# Altium project Common_Sensor_Box.PrjPCB (part 4 of 17)

## Sheet Sensor_Box_Hub_SAMD21.SchDoc: Title
size 420 x 297 mm; Author: G.Kasprowicz; CompanyName: WUT ISE; DrawnBy: G.Kasprowicz; Organization: WUT ISE; Address1: PW ISE; Address2: Nowowiejska 15/19 00-665 Warsaw; Address3: gkasprow@gmail.com; Revision: 1.0; SheetNumber: -; SheetTotal: -; ModifiedBy: -; CheckedDate: -; Title2: Title2; DivGrp: WUT ISE; Designer: G.Kasprowicz; ModifiedDate: -; ProjectName: Sensor Box
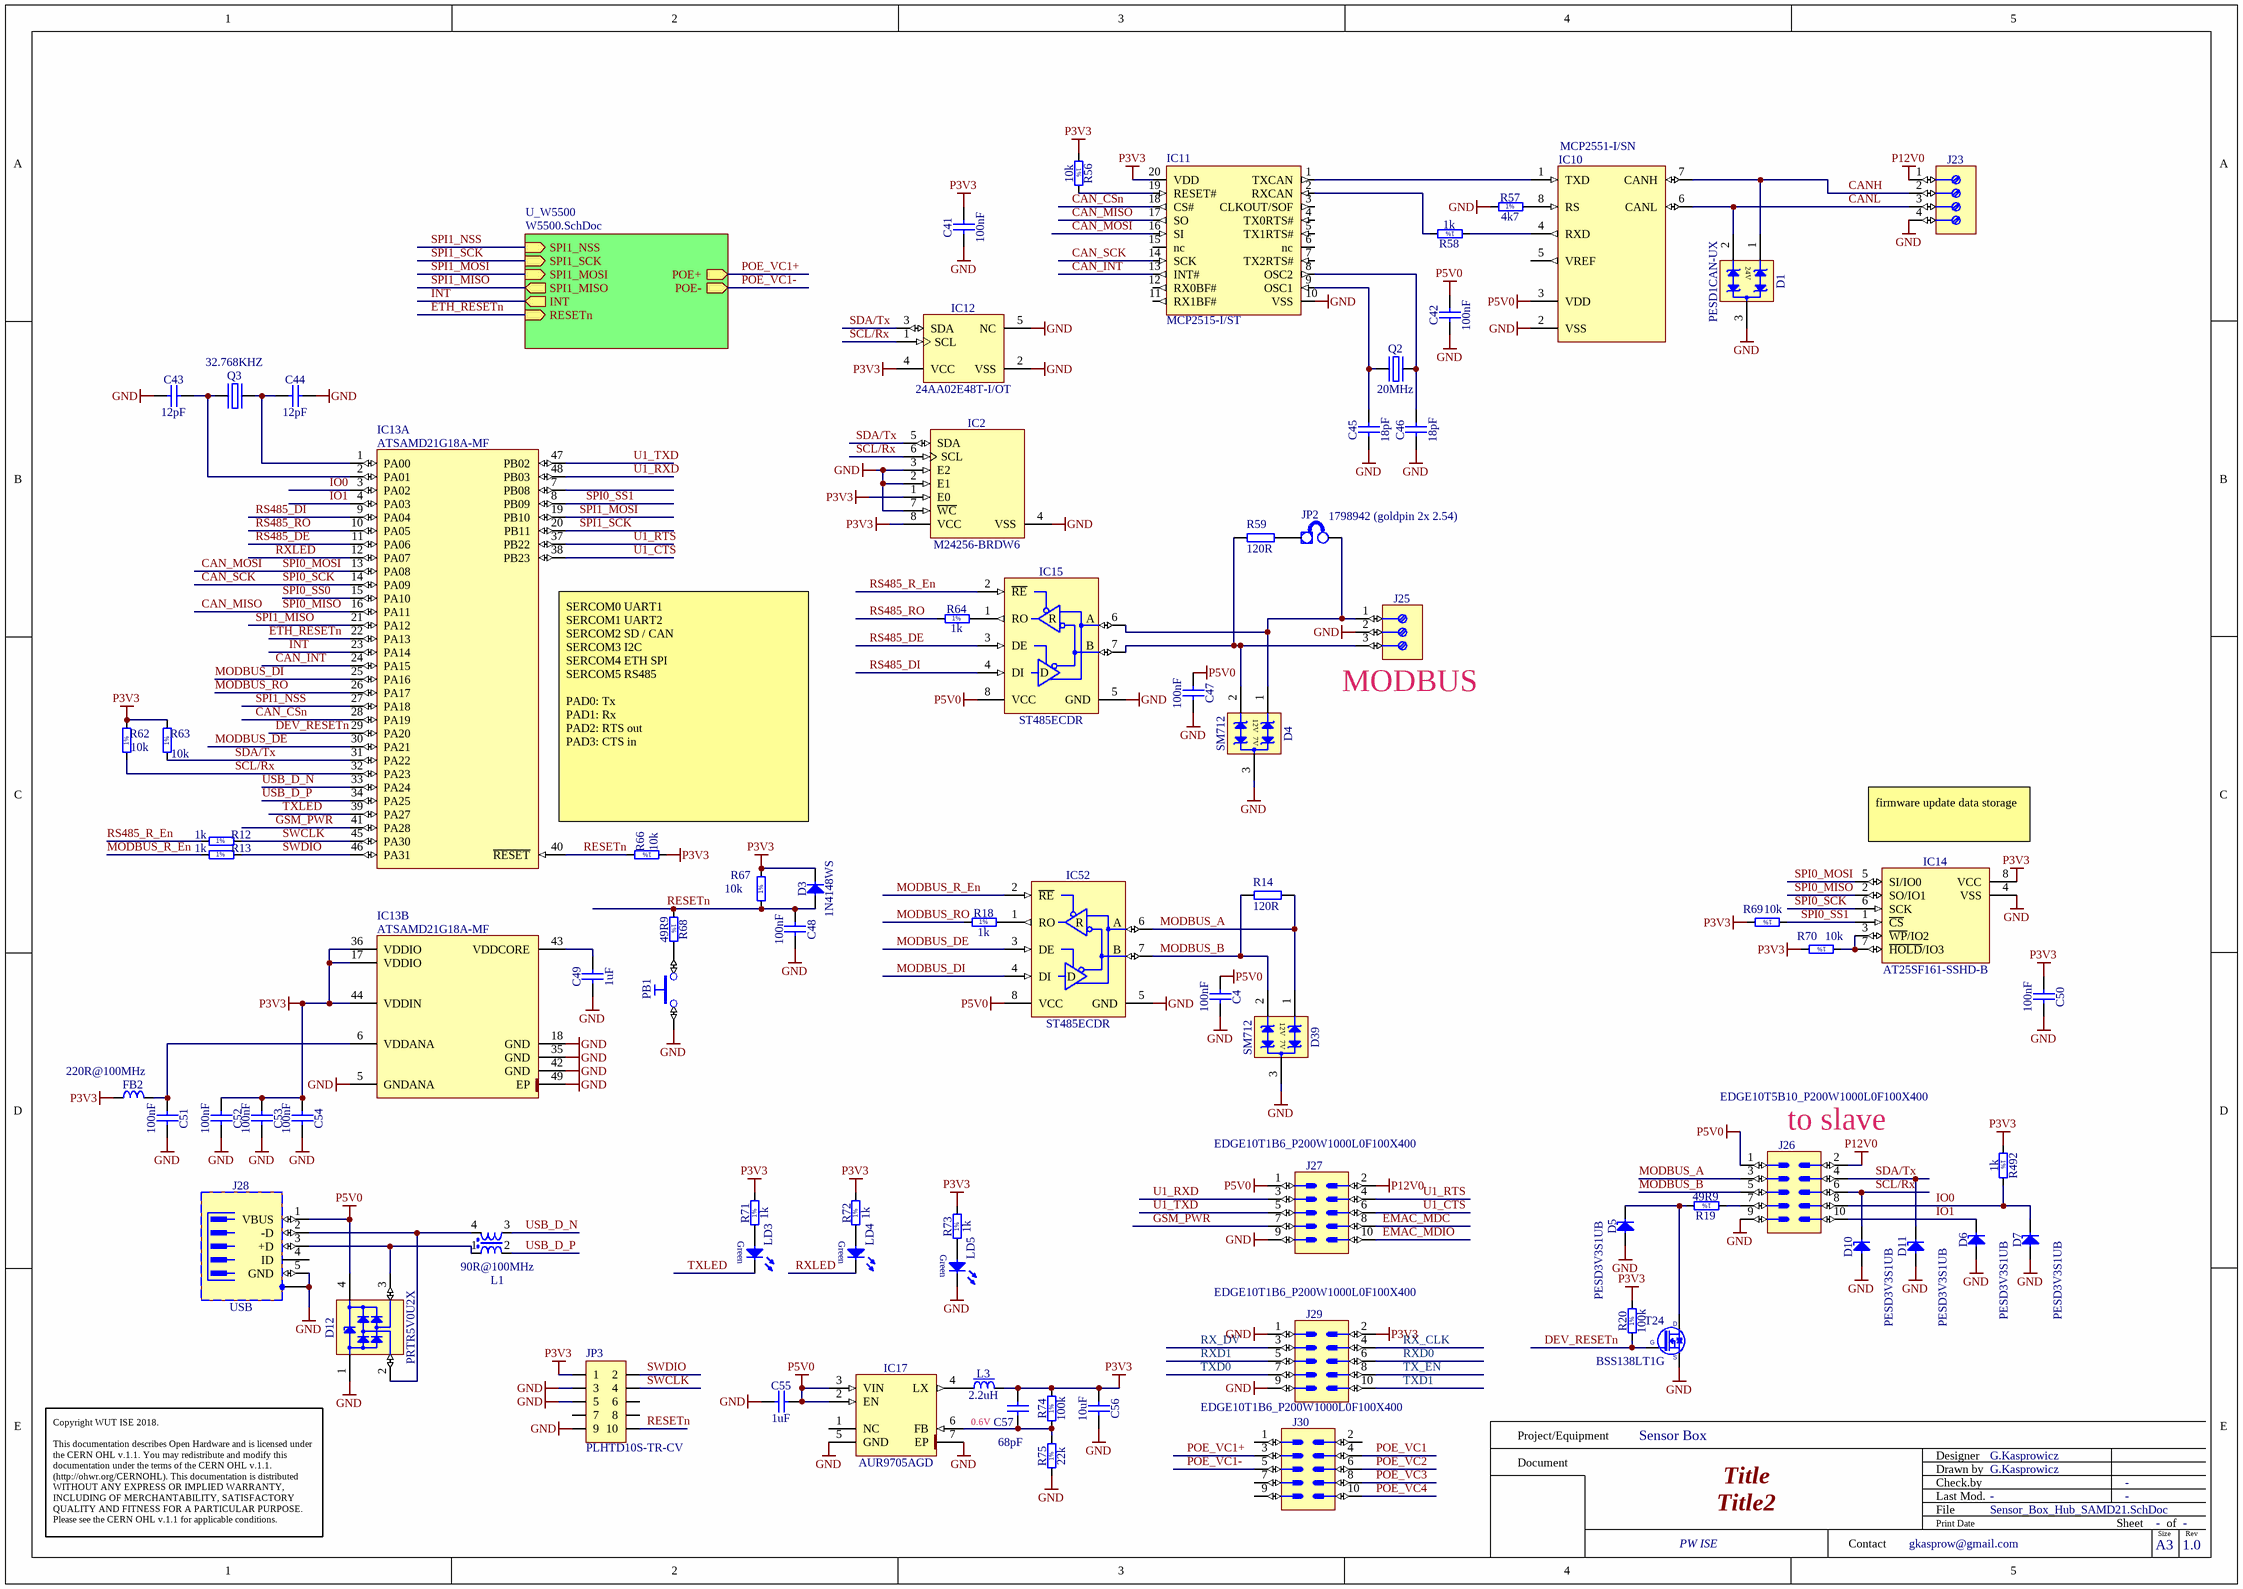
[diagram p5: Sensor_Box_Hub_SAMD21.SchDoc]

### Parts
(Parts that share a designator on the sheet are numbered #1, #2 ... from top to bottom, then left to right.)
C4  100nF  [CAPC1005X55N]
C41  100nF  [CAPC1005X55N]
C42  100nF  [CAPC1005X55N]
C43  12pF  [CAPC1005X55N]
C44  12pF  [CAPC1005X55N]
C45  18pF  [CAPC1005X55N]
C46  18pF  [CAPC1005X55N]
C47  100nF  [CAPC1005X55N]
C48  100nF  [CAPC1005X55N]
C49  1uF  [CAPC1608X87N]
C50  100nF  [CAPC1005X55N]
C51  100nF  [CAPC1005X55N]
C52  100nF  [CAPC1005X55N]
C53  100nF  [CAPC1005X55N]
C54  100nF  [CAPC1005X55N]
C55  1uF  [CAPC1005X55N]
C56  10uF  [CAPC2012X135N]
C57  68pF  [CAPC1608X87N]
D1  PESD1CAN-UX  [SOT95P237X112-3N]
D3  1N4148WS  [SODFL2512X100N]
D4  SM712  [SOT95P237X112-3N]
D5  PESD3V3S1UB  [SODFL1608X65N]
D6  PESD3V3S1UB  [SODFL1608X65N]
D7  PESD3V3S1UB  [SODFL1608X65N]
D10  PESD3V3S1UB  [SODFL1608X65N]
D11  PESD3V3S1UB  [SODFL1608X65N]
D12  PRTR5V0U2X  [SOT190P230X110-4N]
D39  SM712  [SOT95P237X112-3N]
FB2  220R@100MHz  [INDC2012X105N]
IC2#3  M24256-BRDW6  [SOP65P640X120-8N]
IC10  MCP2551-I/SN  [SOIC127P600X175-8N]
IC11  MCP2515-I/ST  [SOP65P640X110-20N]
IC12  24AA02E48T-I/OT  [SOT95P280X145-5N]
IC13  ATSAMD21G18A-MF  [QFN50P700X700X100-49N-S525]  (parts A,B of 2)
IC14  AT25SF161-SSHD-B  [SOIC127P790X216-8N]
IC15  ST485ECDR  [SOIC127P600X175-8N]
IC17  AUR9705AGD  [SON65P200X200X80-7N-R65X145]
IC52#1  ST485ECDR  [SOIC127P600X175-8N]
J23  (no value)  [PHOENIX_1725672]
J25  (no value)  [PHOENIX_1725669]
J26  (no value)  [EDGE10T5B10_P200W1000L0F100X400]
J27  (no value)  [EDGE10T1B6_P200W1000L0F100X400]
J28  USB  [MOLEX_105133-0011]
J29  (no value)  [EDGE10T1B6_P200W1000L0F100X400]
J30  (no value)  [EDGE10T1B6_P200W1000L0F100X400]
JP2  1798942 (goldpin 2x 2.54)  [jump]
JP3  PLHTD10S-TR-CV  [PLHTD10S-TR-CV]
L1  90R@100MHz  [IND_MURATA_DLW21S]
L3  2.2uH  [IND_MURATA_LQH44PN_P0]
LD3  Green  [LED_KINGBRIGHT_KPTR3216]  (value not drawn)
LD4  Green  [LED_KINGBRIGHT_KPTR3216]  (value not drawn)
LD5  Green  [LED_KINGBRIGHT_KPTR3216]  (value not drawn)
PB1  Push Button  [PB_TYCO_FSMSM]  (value not drawn)
Q2  20MHz  [XTAL1160X490X430]
Q3  32.768KHZ  [XTAL_ABRACON_ABS09]
R12  1k  [RESC1005X40N]
R13  1k  [RESC1005X40N]
R14  120R  [1206R]
R18  1k  [RESC1005X40N]
R19  49R9  [RESC1005X40N]
R20  100k  [RESC1005X40N]
R56  10k  [RESC1005X40N]
R57  4k7  [RESC1005X40N]
R58  1k  [RESC1005X40N]
R59  120R  [1206R]
R62  10k  [RESC1005X40N]
R63  10k  [RESC1005X40N]
R64  1k  [RESC1005X40N]
R66  10k  [RESC1005X40N]
R67  10k  [RESC1005X40N]
R68  49R9  [RESC1005X40N]
R69  10k  [RESC1005X40N]
R70  10k  [RESC1005X40N]
R71  1k  [RESC1005X40N]
R72  1k  [RESC1005X40N]
R73  1k  [RESC1005X40N]
R74  100k  [RESC1005X40N]
R75  22k  [RESC1005X40N]
R492  1k  [RESC1005X40N]
T24  BSS138LT1G  [SOT95P240X110-3N]

### Sub-sheets
U_W5500 = W5500.SchDoc: SPI1_NSS (in), SPI1_SCK (in), SPI1_MOSI (in), SPI1_MISO (out), INT (out), RESETn (in), POE+ (out), POE- (out)

### Nets
GND: C4.2 C41.1 C42.1 C43.1 C44.2 C45.1 C46.1 C47.2 C48.2 C49.1 C50.2 C51.2 C52.2 C53.2 C54.2 C55.1 C56.2 D1.3(GND) D4.3(GND) D5.2(A) D6.2(A) D7.2(A) D10.2(A) D11.2(A) D12.1(GND) D39.3(GND) IC2#3.2(E1) IC2#3.3(E2) IC2#3.4(VSS) IC2#3.7(~{WC}) IC10.2(VSS) IC11.10(VSS) IC12.2(VSS) IC12.5(NC) IC13.5(GNDANA) IC13.18(GND) IC13.35(GND) IC13.42(GND) IC13.49(EP) IC14.4(VSS) IC15.5(GND) IC17.5(GND) IC17.7(EP) IC52#1.5(GND) J23.4 J25.2 J26.9 J27.9 J28.5(GND) J28.6(SH) J29.1 J29.9 JP3.3 JP3.5 JP3.9 LD5.1(C) PB1.1 R57.1 R75.1 T24.2(S)
P3V3: C41.2 C50.1 C52.1 C53.1 C54.1 C56.1 C57.2 D3.1(C) FB2.1 IC2#3.1(E0) IC2#3.8(VCC) IC11.20(VDD) IC12.4(VCC) IC13.17(VDDIO) IC13.36(VDDIO) IC13.44(VDDIN) IC14.8(VCC) J29.2 JP3.1 L3.2 R20.2 R56.1 R62.2 R63.2 R66.1 R67.2 R69.2 R70.2 R71.2 R72.2 R73.2 R74.2 R492.1
P5V0: C4.1 C42.2 C47.1 C55.2 D12.4(VCC) IC10.3(VDD) IC15.8(VCC) IC17.2(EN) IC17.3(VIN) IC52#1.8(VCC) J26.1 J27.1 J28.1(VBUS)
P12V0: J23.1 J26.2 J27.2
CAN_CSn: IC11.18(CS#) IC13.28(PA19)
CAN_INT: IC11.13(INT#) IC13.24(PA15)
CAN_MISO: IC11.17(SO) IC13.16(PA11) IC14.2(SO/IO1)  [also labelled SPI0_MISO]
CAN_MOSI: IC11.16(SI) IC13.13(PA08) IC14.5(SI/IO0)  [also labelled SPI0_MOSI]
CAN_SCK: IC11.14(SCK) IC13.14(PA09) IC14.6(SCK)  [also labelled SPI0_SCK]
CANH: D1.1(I/O1) IC10.7(CANH) J23.2
CANL: D1.2(I/O2) IC10.6(CANL) J23.3
DEV_RESETn: IC13.29(PA20) R20.1 T24.1(G)
EMAC_MDC: J27.8
EMAC_MDIO: J27.10
ETH_RESETn: IC13.22(PA13) ; sheet U_W5500/RESETn
GSM_PWR: IC13.41(PA28) J27.7
INT: IC13.23(PA14) ; sheet U_W5500/INT
IO0: D7.1(C) IC13.3(PA02) J26.8 R492.2
IO1: D6.1(C) IC13.4(PA03) J26.10
MODBUS_A: D39.1(I/O1) IC52#1.6(A) J26.3 R14.2
MODBUS_B: D39.2(I/O2) IC52#1.7(B) J26.5 R14.1
MODBUS_DE: IC13.30(PA21) IC52#1.3(DE)
MODBUS_DI: IC13.25(PA16) IC52#1.4(DI)
MODBUS_R_En: IC52#1.2(~{RE}) R13.1
MODBUS_RO: IC13.26(PA17) R18.1
POE_VC1: J30.4
POE_VC1+: J30.3 ; sheet U_W5500/POE+
POE_VC1-: J30.5 ; sheet U_W5500/POE-
POE_VC2: J30.6
POE_VC3: J30.8
POE_VC4: J30.10
RESETn: C48.1 D3.2(A) IC13.40(~{RESET}) JP3.10 R66.2 R67.1 R68.1
RS485_DE: IC13.11(PA06) IC15.3(DE)
RS485_DI: IC13.9(PA04) IC15.4(DI)
RS485_R_En: IC15.2(~{RE}) R12.1
RS485_RO: IC13.10(PA05) R64.1
RX_CLK: J29.4
RX_DV: J29.3
RXD0: J29.6
RXD1: J29.5
RXLED: IC13.12(PA07) LD4.1(C)
SCL/Rx: D10.1(C) IC2#3.6(SCL) IC12.1(SCL) IC13.32(PA23) J26.6 R62.1
SDA/Tx: D11.1(C) IC2#3.5(SDA) IC12.3(SDA) IC13.31(PA22) J26.4 R63.1
SPI0_SS0: IC13.15(PA10)
SPI0_SS1: IC13.8(PB09) IC14.1(~{CS}) R69.1
SPI1_MISO: IC13.21(PA12) ; sheet U_W5500/SPI1_MISO
SPI1_MOSI: IC13.19(PB10) ; sheet U_W5500/SPI1_MOSI
SPI1_NSS: IC13.27(PA18) ; sheet U_W5500/SPI1_NSS
SPI1_SCK: IC13.20(PB11) ; sheet U_W5500/SPI1_SCK
SWCLK: IC13.45(PA30) JP3.4 R12.2
SWDIO: IC13.46(PA31) JP3.2 R13.2
TX_EN: J29.8
TXD0: J29.7
TXD1: J29.10
TXLED: IC13.39(PA27) LD3.1(C)
U1_CTS: IC13.38(PB23) J27.6
U1_RTS: IC13.37(PB22) J27.4
U1_RXD: IC13.48(PB03) J27.3
U1_TXD: IC13.47(PB02) J27.5
USB_D_N: IC13.33(PA24) L1.3
USB_D_P: IC13.34(PA25) L1.2
NetC43_2: C43.2 IC13.2(PA01) Q3.1(OSC1)
NetC44_1: C44.1 IC13.1(PA00) Q3.2(OSC2)
NetC45_2: C45.2 IC11.9(OSC1) Q2.1(OSC1)
NetC46_2: C46.2 IC11.8(OSC2) Q2.2(OSC2)
NetC49_2: C49.2 IC13.43(VDDCORE)
NetC51_1: C51.1 FB2.2 IC13.6(VDDANA)
NetC57_1: C57.1 IC17.6(FB) R74.1 R75.2
NetD4_1: D4.1(I/O1) IC15.6(A) J25.1 JP2.2(E2)
NetD4_2: D4.2(I/O2) IC15.7(B) J25.3 R59.1
NetD5_1: D5.1(C) R19.2 T24.3(D)
NetD12_2: D12.2(I/O1) J28.2(-D) L1.4
NetD12_3: D12.3(I/O2) J28.3(+D) L1.1
NetIC10_1: IC10.1(TXD) IC11.1(TXCAN)
NetIC10_4: IC10.4(RXD) R58.1
NetIC10_8: IC10.8(RS) R57.2
NetIC11_2: IC11.2(RXCAN) R58.2
NetIC11_19: IC11.19(RESET#) R56.2
NetIC14_3: IC14.3(~{WP}/IO2) IC14.7(~{HOLD}/IO3) R70.1
NetIC15_1: IC15.1(RO) R64.2
NetIC17_4: IC17.4(LX) L3.1
NetIC52#1_1: IC52#1.1(RO) R18.2
NetJ26_7: J26.7 R19.1
NetJP2_1: JP2.1(E1) R59.2
NetLD3_2: LD3.2(A) R71.1
NetLD4_2: LD4.2(A) R72.1
NetLD5_2: LD5.2(A) R73.1
NetPB1_2: PB1.2 R68.2

Not connected (* = marked no-connect by the designer): IC10 5(VREF); IC11 3(CLKOUT/SOF) 4(TX0RTS#) 5(TX1RTS#) 6(nc) 7(TX2RTS#) 11(RX1BF#) 12(RX0BF#) 15(nc); IC13 7(PB08); IC17 1(NC); J28 4(ID); J30 1 2 7 9; JP3 6 7 8

### Notes on the sheet
- (near J25) MODBUS
- SERCOM0 UART1
  SERCOM1 UART2
  SERCOM2 SD / CAN
  SERCOM3 I2C
  SERCOM4 ETH SPI
  SERCOM5 RS485
  PAD0: Tx
  PAD1: Rx
  PAD2: RTS out
  PAD3: CTS in
- (near IC14) firmware update data storage
- (near J26) to slave
- 0.6V
- Project/Equipment
- Document
- Designer
- Drawn by
- Check.by
- Copyright WUT ISE 2018.
  This documentation describes Open Hardware and is licensed under the CERN OHL v.1.1. You may redistribute and modify this documentation under the terms of the CERN OHL v.1.1. (http://ohwr.org/CERNOHL). This documentation is distributed WITHOUT ANY EXPRESS OR IMPLIED WARRANTY, INCLUDING OF MERCHANTABILITY, SATISFACTORY QUALITY AND FITNESS FOR A PARTICULAR PURPOSE. Please see the CERN OHL v.1.1 for applicable conditions.
- Contact
- File
- Last Mod.
- Print Date
- Sheet
- Size
- A3
- of
- Rev
- (in symbol R0402_1K_1%_0.0625W_100PPM) 1%
- (in symbol R0402_4K7_1%_0.0625W_100PPM) 1%
- (in symbol R0402_10K_1%_0.0625W_100PPM) 1%
- (in symbol R0402_22K_1%_0.0625W_100PPM) 1%
- (in symbol R0402_49R9_1%_0.0625W_100PPM) 1%
- (in symbol R0402_100K_1%_0.0625W_100PPM) 1%
- (in symbol SM712) 12V; 7V
- (in symbol ST485ECDR) R; D

### Library data of the parts
C4 C47 C48 C50-C54 = CC0402_100NF_16V_10%_X7R: Non-polarised capacitor; Part Description: SMD Multilayer Chip Ceramic Capacitor; Manufacturer: GENERIC; Manufacturer1 Part Number: GRM155R71C104KA88D; Voltage: 16V; TC: X7R; Tolerance: ±10%; Part Number: CC0402_100NF_16V_10%_X7R; Component Kind: Standard; Component Type: Standard; Pin Count: 2; Value: 100nF; Status: Not Recommended; Manufacturer Part Number: CC0402_100NF_16V_10%_X7R; Case: 0402; Mounted: Yes; Socket: No; SMD: Yes; Manufacturer1 Example: MURATA; Manufacturer1 ComponentHeight: 0.55mm; HelpURL: \\cern.ch\dfs\Applications\Altium\Datasheets\CC0402_X7R_MURATA_GRM.pdf; Author: CERN DEM JLC; CreateDate: 05.12.2013; LatestRevisionDate: 03.12.2007; Sense: No
C41 C42 = CC0402_100NF_16V_10%_X5R: Non-polarised capacitor; Part Description: SMD Multilayer Chip Ceramic Capacitor; Manufacturer: GENERIC; Manufacturer1 Part Number: GRM155R61C104KA88D; Voltage: 16V; TC: X5R; Tolerance: ±10%; Part Number: CC0402_100NF_16V_10%_X5R; Component Kind: Standard; Component Type: Standard; Pin Count: 2; Value: 100nF; Status: None; Manufacturer Part Number: CC0402_100NF_16V_10%_X5R; Case: 0402; Mounted: Yes; Socket: No; SMD: Yes; Sense: No; Manufacturer1 Example: MURATA; Manufacturer1 ComponentHeight: 0.55mm; HelpURL: \\cern.ch\dfs\Applications\Altium\Datasheets\CC0402_X5R_MURATA_GRM.pdf; Author: CERN DEM JLC; CreateDate: 10.12.2013; LatestRevisionDate: 10.12.2013
C43 C44 = CC0402_12PF_50V_5%_C0G: Non-polarised capacitor; Part Description: SMD Multilayer Chip Ceramic Capacitor; Manufacturer: GENERIC; Manufacturer1 Part Number: C0402C120J5GACTU; Voltage: 50V; TC: C0G/NP0; Tolerance: ±5%; Part Number: CC0402_12PF_50V_5%_C0G; Component Kind: Standard; Component Type: Standard; Pin Count: 2; Value: 12pF; Status: Preferred; Manufacturer Part Number: CC0402_12PF_50V_5%_C0G; Case: 0402; Mounted: Yes; Socket: No; SMD: Yes; Sense: No; Manufacturer1 Example: KEMET; Manufacturer1 ComponentHeight: 0.55mm; HelpURL: \\cern.ch\dfs\Applications\Altium\Datasheets\CC0805_C0G_KEMET_(Commercial Grade).pdf; Author: CERN DEM JLC; CreateDate: 04.10.2016; LatestRevisionDate: 04.10.2016
C45 C46 = CC0402_18PF_50V_5%_C0G: Non-polarised capacitor; Part Description: SMD Multilayer Chip Ceramic Capacitor; Manufacturer: GENERIC; Manufacturer1 Part Number: C0402C180J5GACTU; Voltage: 50V; TC: C0G/NP0; Tolerance: ±5%; Part Number: CC0402_18PF_50V_5%_C0G; Component Kind: Standard; Component Type: Standard; Pin Count: 2; Value: 18pF; Status: Preferred; Manufacturer Part Number: CC0402_18PF_50V_5%_C0G; Case: 0402; Mounted: Yes; Socket: No; SMD: Yes; Sense: No; Manufacturer1 Example: KEMET; Manufacturer1 ComponentHeight: 0.55mm; HelpURL: \\cern.ch\dfs\Applications\Altium\Datasheets\CC0805_C0G_KEMET_(Commercial Grade).pdf; Author: CERN DEM JLC; CreateDate: 04.10.2016; LatestRevisionDate: 04.10.2016
C49 = CC0603_1UF_16V_10%_X7R: Non-polarised capacitor; Part Description: SMD Multilayer Chip Ceramic Capacitor; Manufacturer: GENERIC; Manufacturer1 Part Number: 223878615663; Voltage: 16V; TC: X7R; Tolerance: ±10%; Part Number: CC0603_1UF_16V_10%_X7R; Component Kind: Standard; Component Type: Standard; Pin Count: 2; Value: 1uF; Status: None; Manufacturer Part Number: CC0603_1uF_16V_10%_X7R; Case: 0603; Mounted: Yes; Socket: No; SMD: Yes; Sense: No; Manufacturer1 Example: YAGEO PHYCOMP; Manufacturer1 ComponentHeight: 0.9mm; HelpURL: \\cern.ch\dfs\Applications\Altium\Datasheets\CC0603_X7R_PHYCOMP.pdf; Author: CERN DEM JLC; CreateDate: 03.12.2007; LatestRevisionDate: 17.04.2015
C55 = CC0402_1UF_16V_10%_X5R: Non-polarised capacitor; Part Description: SMD Multilayer Chip Ceramic Capacitor; Manufacturer: GENERIC; Manufacturer1 Part Number: C1005X5R1C105KT; Voltage: 16V; TC: X5R; Tolerance: ±10%; Part Number: CC0402_1UF_16V_10%_X5R; Component Kind: Standard; Component Type: Standard; Pin Count: 2; Value: 1uF; Status: Preferred; Manufacturer Part Number: CC0402_1UF_16V_10%_X5R; Case: 0402; Mounted: Yes; Socket: No; SMD: Yes; Sense: No; Manufacturer1 Example: TDK; Manufacturer1 ComponentHeight: 0.55mm; HelpURL: \\cern.ch\dfs\Applications\Altium\Datasheets\CC0402_X5R_TDK_C.pdf; Author: CERN DEM JLC; CreateDate: 25.10.2012; LatestRevisionDate: 25.10.2012
C56 = CC0805_10UF_16V_10%_X5R: Non-polarised capacitor; Part Description: SMD Multilayer Chip Ceramic Capacitor; Manufacturer: GENERIC; Manufacturer1 Part Number: C0805C106K4PAC; Voltage: 16V; TC: X5R; Tolerance: ±10%; Part Number: CC0805_10UF_16V_10%_X5R; Component Kind: Standard; Component Type: Standard; Pin Count: 2; Value: 10uF; Status: Preferred; Manufacturer Part Number: CC0805_10UF_16V_10%_X5R; Case: 0805; Mounted: Yes; Socket: No; SMD: Yes; Manufacturer1 Example: KEMET; Manufacturer1 ComponentHeight: 1.4mm; HelpURL: \\cern.ch\dfs\Applications\Altium\Datasheets\CC1206_X5R_KEMET.pdf; Author: CERN DEM JLC; CreateDate: 03.12.2007; LatestRevisionDate: 03.12.2007; Sense: No
C57 = CC0603_68PF_50V_5%_NP0: Non-polarised capacitor; Part Description: SMD Multilayer Chip Ceramic Capacitor; Manufacturer: GENERIC; Manufacturer1 Part Number: 223886715689; Voltage: 50V; TC: C0G/NP0; Tolerance: ±5%; Part Number: CC0603_68PF_50V_5%_NP0; Component Kind: Standard; Component Type: Standard; Pin Count: 2; Value: 68pF; Status: Preferred; Manufacturer Part Number: CC0603_68PF_50V_5%_NP0; Case: 0603; Mounted: Yes; Socket: No; SMD: Yes; Sense: No; Manufacturer1 Example: PHYCOMP; Manufacturer1 ComponentHeight: 0.87mm; HelpURL: \\cern.ch\dfs\Applications\Altium\Datasheets\CC0603_NP0_PHYCOMP.pdf; Author: CERN DEM JLC; CreateDate: 03.12.2007; LatestRevisionDate: 03.12.2007
D1 = D_TVS_PESD1CAN: TVS Diode for CAN; Manufacturer: Nexperia; Voltage: 24V; Power: 400W; PressFit: No; Bonding: No; Part Number: PESD1CAN-UX; Component Kind: Standard; Component Type: Standard; Device: PESD1CAN-UX; PackageDescription: SOT, 0.95mm, pitch; 3 pin,1.30mm W X 2.92mm L X 1.12mm H body, IPC Medium Density; Part Description: TVS Diode for CAN; Manufacturer Part Number: PESD1CAN-UX; Pin Count: 3; Case: SOT-23; Mounted: Yes; Socket: No; SMD: Yes; Sense: No; ComponentHeight: 1.12mm; HelpURL: \\cern.ch\dfs\Applications\Altium\Datasheets\SM712.TCT.pdf; Author: CERN DEM JLC; CreateDate: 03.09.2014; LatestRevisionDate: 13.01.2015
D3 = 1N4148WS: Diode; Part Description: Small Signal Diodes; Manufacturer: FAIRCHILD SEMICONDUCTOR; Voltage: 75V; Power: 150mA; PressFit: No; Bonding: No; Part Number: 1N4148WS; Component Kind: Standard; Component Type: Standard; Device: 1N4148WS; PackageDescription: SODFL Diode; 1.70mm W X 1.25mm L X 1.00mm H body, IPC Medium Density; Manufacturer Part Number: 1N4148WS; Pin Count: 2; Case: SOD-323F; Mounted: Yes; Socket: No; SMD: Yes; Sense: No; ComponentHeight: 1mm; HelpURL: \\cern.ch\dfs\Applications\Altium\Datasheets\1N4148WS.pdf; Author: CERN DEM JLC; CreateDate: 12.05.2011; LatestRevisionDate: 12.05.2011
D4 D39 = SM712: Asymmetrical TVS Diode for Extended Common-Mode RS-485; Manufacturer: SEMTECH; Voltage: 12V/-7V; Power: 400W; PressFit: No; Bonding: No; Part Number: SM712; Component Kind: Standard; Component Type: Standard; Device: SM712; PackageDescription: SOT, 0.95mm, pitch; 3 pin,1.30mm W X 2.92mm L X 1.12mm H body, IPC Medium Density; Status: Obsolete; Part Description: Asymmetrical TVS Diode for Extended Common-Mode RS-485; Manufacturer Part Number: SM712; Pin Count: 3; Case: SOT-23; Mounted: Yes; Socket: No; SMD: Yes; Sense: No; ComponentHeight: 1.12mm; HelpURL: \\cern.ch\dfs\Applications\Altium\Datasheets\SM712.pdf; Author: CERN DEM JLC; CreateDate: 23.04.2012; LatestRevisionDate: 23.04.2012
D5-D7 D10 D11 = PESD3V3S1UB: ESD protection diode; Part Description: ESD protection diode (23kV); Manufacturer: NXP SEMICONDUCTORS; Voltage: 3V3; Power: 330W; PressFit: No; Bonding: No; Part Number: PESD3V3S1UB; Component Kind: Standard; Component Type: Standard; Device: PESD3V3S1UB; PackageDescription: Ultra Small Outline Diode Flat Lead (SOD-523), Body; 1.2mm L X 0.8mm W X 0.65mm H, IPC Medium Density; Manufacturer Part Number: PESD3V3S1UB; Pin Count: 2; Case: SOD523; Mounted: Yes; Socket: No; SMD: Yes; Sense: No; ComponentHeight: 0.65mm; HelpURL: \\cern.ch\dfs\Applications\Altium\Datasheets\PESD3V3S1UB.pdf; Author: CERN DEM JLC; CreateDate: 29.11.2012; LatestRevisionDate: 29.11.2012
D12 = PRTR5V0U2X: Ultra Low Capacitance Double Rail-to-Rail ESD Protection Diode; Part Description: Ultra Low Capacitance (1pF) Double Rail-to-Rail ESD Protection Diode (8kV); Manufacturer: NXP SEMICONDUCTORS; Voltage: 5.5V; PressFit: No; Bonding: No; Table: Diodes; Part Number: PRTR5V0U2X; Component Kind: Standard; Component Type: Standard; Device: PRTR5V0U2X; PackageDescription: SOT143B, SOT, 1.90mm Pitch; 4 Pin, 1.30mm W X 2.90mm L X 1.10mm H body, IPC Medium Density; Manufacturer Part Number: PRTR5V0U2X; Pin Count: 4; Case: SOT143B; Mounted: Yes; Socket: No; SMD: Yes; ComponentHeight: 1.1mm; HelpURL: \\cern.ch\dfs\Applications\Altium\Datasheets\PRTR5V0U2X.pdf; Author: CERN DEM JLC; CreateDate: 2011-03-22; LatestRevisionDate: 2011-03-22
FB2 = IND0805_MURATA_BLM21PG221SN1D: Inductor; Part Description: SMD EMIFIL Suppression Chip Ferrite Bead; Manufacturer: MURATA; Power: 2A; Resistance: 0.05R; Tolerance: ±25%; Table: Inductors SMD; Part Number: IND0805_MURATA_BLM21PG221SN1D; Component Kind: Standard; Component Type: Standard; Pin Count: 2; Value: 220R@100MHz; Status: None; Manufacturer Part Number: BLM21PG221SN1D; Case: 0805; Mounted: Yes; Socket: No; SMD: Yes; ComponentHeight: 1.05mm; HelpURL: \\cern.ch\dfs\Applications\Altium\Datasheets\IND0402_MURATA_BLM21P.pdf; Author: CERN DEM JLC; CreateDate: 2010-01-25; LatestRevisionDate: 2010-01-25
IC2#3 = MEM_M24256-BRDW6P: 256-Kbit Serial I²C Bus EEPROM; Manufacturer: ST MICROELECTRONICS; PressFit: No; Bonding: No; Part Number: M24256-BRDW6P; Component Kind: Standard; Component Type: Standard; Device: M24256-BRDW6; PackageDescription: SOP, 0.65mm pitch; 8 pin, 4.40mm W X 3.00mm L X 1.20mm H body, IPC Medium Density; Part Description: 256-Kbit Serial I²C Bus EEPROM; Manufacturer Part Number: M24256-BRDW6; Pin Count: 8; Case: TSSOP8; Mounted: Yes; Socket: No; SMD: Yes; Sense: No; ComponentHeight: 1.2mm; HelpURL: \\cern.ch\dfs\Applications\Altium\Datasheets\M24256-BRDW6P.pdf; Author: CERN DEM MR; CreateDate: 17.03.2016; LatestRevisionDate: 17.03.2016
IC10 = IFC_MCP2551: High-Speed CAN Transceiver, 8-Pin SOIC, Industrial Temperature; Manufacturer: MICROCHIP TECHNOLOGY; PressFit: No; Bonding: No; Part Number: MCP2551-I/SN; Component Kind: Standard; Component Type: Standard; Device: MCP2551-I/SN; PackageDescription: SOIC 8, Pitch 1.27mm - Body 4x5mm, IPC Medium Density; Part Description: High-Speed CAN Transceiver; Manufacturer Part Number: MCP2551-I/SN; Pin Count: 8; Case: SOIC8; Mounted: Yes; Socket: No; SMD: Yes; Sense: No; ComponentHeight: 1.75mm; Author: GK; CreateDate: 07.09.2016; LatestRevisionDate: 07.09.2016
IC11 = IFC_MCP2515_TSSOP: CAN Controller With SPI nterface; Manufacturer: Microchip; Manufacturer Part Number: MCP2515T-I/ST; Part Description: Stand-Alone CAN Controller with SPI Interface; Case: TSSOP20; Component Type: Standard; Device: MCP2515; Mounted: Yes; PackageDescription: TSSOP 20, Pitch 0.65mm - Body 4.5x6.5mm, IPC Medium Density; Part Number: MCP2515T-I/ST; Pin Count: 20; SMD: Yes
IC12 = 24AA02E48T-I/OT: 1.7V-5.5V, 2K I2C Serial EEPROM With EUI-48 Node Identity; Manufacturer: MICROCHIP TECHNOLOGY; PressFit: No; Bonding: No; Part Number: 24AA02E48T-I/OT; Component Kind: Standard; Component Type: Standard; Device: 24AA02E48T-I/OT; PackageDescription: SOT, 0.95mm pitch; 5 pin, 1.60mm W X 2.90mm L X 1.45mm H body, IPC Medium Density; Part Description: 1.7V-5.5V, 2K I2C Serial EEPROM With EUI-48 Node Identity; Manufacturer Part Number: 24AA02E48T-I/OT; Pin Count: 5; Case: SOT23-5; Mounted: Yes; Socket: No; SMD: Yes; Sense: No; ComponentHeight: 1.45mm; HelpURL: \\cern.ch\dfs\Applications\Altium\Datasheets\24AA02E48T-I-OT.pdf; Author: CERN DEM MR; CreateDate: 31.03.2016; LatestRevisionDate: 31.03.2016
IC13 = ATSAMD21G18A-MF: 32-bit ARM®-based Cortex®-M0+ core Microcontroller, 1.62V to 3.6V, 48MHz, 256KB Flash, 32KB of SRAM, 48 QFN, Industrial Grade (-40°C to 125°C); Part Description: 32-bit ARM®-based Cortex®-M0+ core Microcontroller, 1.62V to 3.6V, 48MHz, 256KB Flash, 32KB SRAM, 48 QFN, Temperature Range -40°C to 125°C; Manufacturer: MICROCHIP; PressFit: No; Bonding: No; Part Number: ATSAMD21G18A-MF; Component Kind: Standard; Component Type: Standard; Device: ATSAMD21G18A-MF; PackageDescription: QFN, 0.50mm Pitch, Square; 48 Pin, 7.00mm L X 7.00mm W X 1mm H Body (W/Thermal Tab 5.25mm X 5.25mm), IPC Medium Density; Manufacturer Part Number: ATSAMD21G18A-MF; Pin Count: 49; Case: QFN48; Mounted: Yes; Socket: No; SMD: Yes; Sense: No; ComponentHeight: 1mm; HelpURL: \\cern.ch\dfs\Applications\Altium\Datasheets\ATSAMD21G18A-MF.pdf; Author: CERN DEM BC; CreateDate: 23.01.2018; LatestRevisionDate: 23.01.2018
IC14 = MEM_AT25SF161: 16Mb, 3V, Multiple I/O Serial NOR Flash Memory; Part Description: 16Mb, 2.7 to 3.6V, SPI Flash Memory; PressFit: No; Bonding: No; Part Number: AT25SF161-SSHD-B; Component Kind: Standard; Component Type: Standard; Device: AT25SF161-SSHD-B; PackageDescription: SOIC, 1.27mm Pitch; 8 Pin, 5.285mm W X 5.335mm L X 2.16mm H body, IPC Medium Density; Manufacturer Part Number: AT25SF161-SSHD-B; Pin Count: 8; Case: SOIC8; Mounted: Yes; Socket: No; SMD: Yes; Sense: No; ComponentHeight: 2.16mm; HelpURL: \\cern.ch\dfs\Applications\Altium\Datasheets\N25Q128A13ESE40.pdf; Author: GK; CreateDate: 28.11.2011; LatestRevisionDate: 30.07.2015
IC15 IC52#1 = ST485ECDR: ±15kV ESD-Protected, Low Power  RS-485/RS-422 Transceiver; Manufacturer: ST MICROELECTRONICS; PressFit: No; Bonding: No; Part Number: ST485ECDR; Component Kind: Standard; Component Type: Standard; Device: ST485ECDR; PackageDescription: SOIC 8, Pitch 1.27mm - Body 4x5mm, IPC Medium Density; Part Description: ±15kV ESD-Protected, Low Power  RS-485/RS-422 Transceiver; Manufacturer Part Number: ST485ECDR; Pin Count: 8; Case: SOIC8; Mounted: Yes; Socket: No; SMD: Yes; Sense: No; ComponentHeight: 1.75mm; Author: CERN DEM MR; HelpURL: \\cern.ch\dfs\Applications\Altium\Datasheets\ST485ECDR.pdf; CreateDate: 15.02.2018; LatestRevisionDate: 15.02.2018
IC17 = AUR9705AGD: 0V to 6V Input, 1A, 1.5MHz, Step-Down DC-DC Converter; Manufacturer: DIODES INCORPORATED; PressFit: No; Bonding: No; Part Number: AUR9705AGD; Component Kind: Standard; Component Type: Standard; Device: AUR9705AGD; PackageDescription: SON, 0.65mm Pitch, 6 Pin, 2.00mm W X 2.00mm L X 0.80mm H body (W/Thermal Tab 0.65mm X 1.45mm), IPC Medium Density; Part Description: 0V to 6V Input, 1A, 1.5MHz, Step-Down DC-DC Converter; Manufacturer Part Number: AUR9705AGD; Pin Count: 7; Case: SON6; Mounted: Yes; Socket: No; SMD: Yes; Sense: No; ComponentHeight: 0.8mm; HelpURL: \\cern.ch\dfs\Applications\Altium\Datasheets\AUR9705AGD.pdf; Author: CERN DEM MR; CreateDate: 15.02.2018; LatestRevisionDate: 15.02.2018
J23 = PHOENIX_1725672: Terminal Block, 4 Positions, Screw Connection; Part Description: 6A, 63V, Terminal Block, Pitch 2.54mm, 4 Positions, Screw Connection; Manufacturer: PHOENIX CONTACT; Manufacturer Part Number: 1725672 (MPT 0,5/4-2,54); PressFit: No; Part Number: PHOENIX_1725672; Component Kind: Standard; Component Type: Standard; Pin Count: 4; Mounted: Yes; Socket: No; SMD: No; Sense: No; Status: None; ComponentHeight: 8.5mm; HelpURL: \\cern.ch\dfs\Applications\Altium\Datasheets\PHOENIX_1725672.pdf; Author: CERN DEM JMW; CreateDate: 07.11.2008; LatestRevisionDate: 26.04.2010
J25 = PHOENIX_1725669: Terminal Block, 3 Positions, Screw Connection; Part Description: 6A, 63V, Terminal Block, Pitch 2.54mm, 3 Positions, Screw Connection; Manufacturer: PHOENIX CONTACT; Manufacturer Part Number: 1725669 (MPT 0,5/3-2,54); PressFit: No; Part Number: PHOENIX_1725669; Component Kind: Standard; Component Type: Standard; Pin Count: 3; Mounted: Yes; Socket: No; SMD: No; Sense: No; Status: None; ComponentHeight: 8.5mm; HelpURL: \\cern.ch\dfs\Applications\Altium\Datasheets\PHOENIX_1725669.pdf; Author: CERN DEM JMW; CreateDate: 07.11.2008; LatestRevisionDate: 26.04.2010
J26 = EDGE10T5B10_P200W1000L0F100X400: PCB Edge Connector 10 (2x5); Part Description: 10 Contacts Board Edge Connector, Pitch 2mm, Length 0mm, Width 10mm, Finger Lenght 4mm, Finger Width 1mm; Mounted: No; PressFit: No; Part Number: EDGE10T5B10_P200W1000L0F100X400; Component Kind: Standard (No BOM); Component Type: Standard (No BOM); Pin Count: 10; Socket: No; SMD: No; Sense: No; Status: None; ComponentHeight: 0mm; HelpURL: \\cern.ch\dfs\Applications\Altium\Datasheets\EDGE10T5B10_P200W1000L0F100X400.pdf; Author: CERN DEM MR; CreateDate: 14.02.2018; LatestRevisionDate: 14.02.2018
J27 J29 J30 = EDGE10T1B6_P200W1000L0F100X400: PCB Edge Connector 10 (2x5); Part Description: 10 Contacts Board Edge Connector, Pitch 2mm, Length 0mm, Width 10mm, Finger Lenght 4mm, Finger Width 1mm; Mounted: No; PressFit: No; Part Number: EDGE10T1B6_P200W1000L0F100X400; Component Kind: Standard (No BOM); Component Type: Standard (No BOM); Pin Count: 10; Socket: No; SMD: No; Sense: No; Status: None; ComponentHeight: 0mm; HelpURL: \\cern.ch\dfs\Applications\Altium\Datasheets\EDGE10T1B6_P200W1000L0F100X400.pdf; Author: CERN DEM MR; CreateDate: 14.02.2018; LatestRevisionDate: 14.02.2018
J28 = MOLEX_105133-0011: 5 Pin + 1 Shield USB Receptacle; Part Description: 0.65mm Pitch, Micro-USB Type B Surface Mounte Vertical Receptacle; Manufacturer: MOLEX; PressFit: No; Part Number: MOLEX_105133-0011; Component Kind: Standard; Component Type: Standard; Pin Count: 8; Family: USB; Mounted: Yes; Socket: No; SMD: Yes; Sense: No; Status: None; Manufacturer Part Number: 105133-0011; ComponentHeight: 6.7mm; HelpURL: \\cern.ch\dfs\Applications\Altium\Datasheets\MOLEX_105133-0011.pdf; Author: CERN DEM MR; CreateDate: 13.12.2017; LatestRevisionDate: 13.12.2017
JP2 = JUMPER: Supplier 1: Farnell; Supplier Part Number 1: 1798942
JP3 = CON_2x5 1.27 SMT Male: 1.27 mm dual row goldpin (Maritex)
L1 = IND_MURATA_DLW21SN900SQ2L: Inductor Common Mode; Part Description: Wire Wound Common Mode Choke Coil (DLW21S Series); Manufacturer: MURATA; Power: 330mA; Resistance: 0.35R; Tolerance: ±25%; Table: Inductors SMD; Part Number: IND_MURATA_DLW21SN900SQ2L; Component Kind: Standard; Component Type: Standard; Pin Count: 4; Value: 90R@100MHz; Status: None; Manufacturer Part Number: DLW21SN900SQ2L; Case: 0805; Mounted: Yes; Socket: No; SMD: Yes; ComponentHeight: 1.4mm; HelpURL: \\cern.ch\dfs\Applications\Altium\Datasheets\IND_MURATA_DLW21S.pdf; Author: CERN DEM JLC; CreateDate: 2014-07-01; LatestRevisionDate: 2014-07-01
L3 = IND_2.2UH_20%_MURATA_LQH44PN2R2MP0L: Inductor With Core; Part Description: Wire Wound Ferrite Inductor for Power Lines; Manufacturer: MURATA; Power: 1.8A; Resistance: 0R049; Tolerance: ±20%; Part Number: IND_2.2UH_20%_MURATA_LQH44PN2R2MP0L; Component Kind: Standard; Component Type: Standard; Pin Count: 2; Value: 2.2uH; Status: None; Manufacturer Part Number: LQH44PN2R2MP0L; Case: 4040; Mounted: Yes; Socket: No; SMD: Yes; Sense: No; ComponentHeight: 1.8mm; HelpURL: \\cern.ch\dfs\Applications\Altium\Datasheets\IND_MURATA_LQH44PN_P0.pdf; Author: CERN DEM JLC; CreateDate: 14.02.2018; LatestRevisionDate: 14.02.2018
LD3-LD5 = LED_KINGBRIGHT_KPTR-3216CGCK: LED Green 1A 2C; Part Description: Reverse Mount LED 1.4x1.6mm Green; PressFit: No; Bonding: No; Part Number: LED_KINGBRIGHT_KPTR-3216CGCK; Component Kind: Standard; Component Type: Standard; Color: Green; PackageDescription: Reverse Mount LED 3216, Hole 2.1x2.3mm 0.35mm Height; Manufacturer: KINGBRIGHT; Manufacturer Part Number: KPTR-3216CGCK; Pin Count: 2; Mounted: Yes; Socket: No; SMD: Yes; Sense: No; ComponentHeight: 0.35mm; HelpURL: \\cern.ch\dfs\Applications\Altium\Datasheets\LED_KINGBRIGHT_KPTR-3216CGCK.pdf; Author: CERN DEM MR; CreateDate: 15.02.2016; LatestRevisionDate: 15.02.2016
PB1 = PB_TYCO_FSMSM: Push-Button Switch SPDT; Part Description: 12VDC 50mA SPST Tactile  Push-Button Switch; Manufacturer: TYCO ELECTRONICS; Manufacturer Part Number: FSMSM or 1437566-3; PressFit: No; Part Number: PB_TYCO_FSMSM; Component Kind: Standard; Component Type: Standard; Pin Count: 2; PackageDescription: Body 3.5x6.0mm, Pushbutton Switch,  TYCO ALCOSWITCH FSMSM Serie; Family: Push Button; Mounted: Yes; Socket: No; SMD: Yes; Sense: No; Status: None; ComponentHeight: 4.3mm; HelpURL: \\cern.ch\dfs\Applications\Altium\Datasheets\PB_TYCO_FSMSM.pdf; Author: CERN DEM JLC; CreateDate: 30.06.2008; LatestRevisionDate: 21.06.2012
Q2 = X_CRYSTAL_20M_HC49: Quartz Crystal 20MHz, 30ppm, 20pF; Part Number: SR PASSIVES 20M-49SMD-SR; Part Description: Tolerance:± 30ppm, Stability:± 50ppm, -10°C to +60°C, 20pF, Surface Mount Quartz Crystal, HC49/4HSMX Series; Manufacturer: SR PASSIVES; Manufacturer Part Number: 20M-49SMD-SR; PressFit: No; Bonding: No; Component Kind: Standard; Component Type: Standard; PackageDescription: HC49/4H SMX Case, SMD Cristal, Body 11.6x4.9mm; Value: 20MHz; Pin Count: 2; Mounted: Yes; Socket: No; SMD: Yes; Sense: No; ComponentHeight: 4.3mm; HelpURL: \\cern.ch\dfs\Applications\Altium\Datasheets\XTAL_IQD_LFXTAL003166.pdf; Author: GK; CreateDate: 19.04.2012; LatestRevisionDate: 07.11.2016
Q3 = XTAL_32.768KHZ_ABRACON_ABS09-32.768KHZ-T: Quartz Crystal; Part Description: Tolerance: ±20ppm, Stability: ±5ppm, -40°C to +85°C, 12.5pF, SMD Low Profile Crystal, ABS09 Series; PressFit: No; Bonding: No; Part Number: XTAL_32.768KHZ_ABRACON_ABS09-32.768KHZ-T; Component Kind: Standard; Component Type: Standard; PackageDescription: 2 Pins, 4.1x1.5mm, SMD Low Profile Crystal, ABS09 Serie; Value: 32.768KHZ; Manufacturer: ABRACON; Manufacturer Part Number: ABS09-32.768KHZ-T; Pin Count: 2; Mounted: Yes; Socket: No; SMD: Yes; Sense: No; ComponentHeight: 0.9mm; HelpURL: \\cern.ch\dfs\Applications\Altium\Datasheets\XTAL_ABRACON_ABS09.pdf; Author: CERN DEM JLC; CreateDate: 16.10.2014; LatestRevisionDate: 16.10.2014
R12 R13 R18 R58 R64 R71-R73 R492 = R0402_1K_1%_0.0625W_100PPM: Resistor - 1%; Part Description: General Purpose Thick Film Chip Resistor; Manufacturer: GENERIC; Manufacturer1 Part Number: 232270671002L; TC: ±100ppm/°C; PressFit: No; Part Number: R0402_1K_1%_0.0625W_100PPM; Component Kind: Standard; Component Type: Standard; Pin Count: 2; Value: 1k; Status: Not Recommended; Power: 0.0625W; Tolerance: ±1%; Manufacturer Part Number: R0402_1K_1%_0.0625W_100PPM; Case: 0402; Mounted: Yes; Sense: No; Socket: No; SMD: Yes; Manufacturer1 Example: YAGEO PHYCOMP; Manufacturer1 ComponentHeight: 0.4mm; HelpURL: \\cern.ch\dfs\Applications\Altium\Datasheets\R0402_Phycomp_RC0402.pdf; Author: CERN DEM JLC; CreateDate: 03.12.2007; LatestRevisionDate: 17.10.2012
R14 R59 = RES_1206: SMD Resistor; Supplier 1: Newark; Supplier Part Number 1: 39K0871
R19 R68 = R0402_49R9_1%_0.0625W_100PPM: Resistor - 1%; Part Description: General Purpose Thick Film Chip Resistor; Manufacturer: GENERIC; Manufacturer1 Part Number: 232270674999L or RC0402FR-0749R9L; TC: ±100ppm/°C; Table: Resistors SMD; Part Number: R0402_49R9_1%_0.0625W_100PPM; Component Kind: Standard; Component Type: Standard; Pin Count: 2; Value: 49R9; Status: Not recommended; Power: 0.0625W; Tolerance: ±1%; Manufacturer Part Number: R0402_49R9_1%_0.0625W_100PPM; Case: 0402; Mounted: Yes; Socket: No; SMD: Yes; Manufacturer1 Example: YAGEO PHYCOMP; Manufacturer1 ComponentHeight: 0.4mm; HelpURL: \\cern.ch\dfs\Applications\Altium\Datasheets\R0402_Phycomp_RC0402.pdf; Author: CERN DEM JLC; CreateDate: 2012-10-24; LatestRevisionDate: 2012-10-24
R20 R74 = R0402_100K_1%_0.0625W_100PPM: Resistor - 1%; Part Description: General Purpose Thick Film Chip Resistor; Manufacturer: GENERIC; Manufacturer1 Part Number: 232270671004L; TC: ±100ppm/°C; PressFit: No; Part Number: R0402_100K_1%_0.0625W_100PPM; Component Kind: Standard; Component Type: Standard; Pin Count: 2; Value: 100k; Status: Not Recommended; Power: 0.0625W; Tolerance: ±1%; Manufacturer Part Number: R0402_100K_1%_0.0625W_100PPM; Case: 0402; Mounted: Yes; Sense: No; Socket: No; SMD: Yes; Manufacturer1 Example: YAGEO PHYCOMP; Manufacturer1 ComponentHeight: 0.4mm; HelpURL: \\cern.ch\dfs\Applications\Altium\Datasheets\R0402_Phycomp_RC0402.pdf; Author: CERN DEM JLC; CreateDate: 03.12.2007; LatestRevisionDate: 17.10.2012
R56 = R0402_10K_1%_0.0625W_100PPM: Resistor - 1%; Part Description: General Purpose Thick Film Chip Resistor; Manufacturer: GENERIC; Manufacturer1 Part Number: 232270671003L; TC: ±100ppm/°C; PressFit: No; Part Number: R0402_10K_1%_0.0625W_100PPM; Component Kind: Standard; Component Type: Standard; Pin Count: 2; Value: 10k; Status: Not Recommended; Power: 0.0625W; Tolerance: ±1%; Manufacturer Part Number: R0402_10K_1%_0.0625W_100PPM; Case: 0402; Mounted: Yes; Sense: No; Socket: No; SMD: Yes; Manufacturer1 Example: YAGEO PHYCOMP; Manufacturer1 ComponentHeight: 0.4mm; HelpURL: \\cern.ch\dfs\Applications\Altium\Datasheets\R0402_Phycomp_RC0402.pdf; Author: CERN DEM JLC; CreateDate: 03.12.2007; LatestRevisionDate: 17.10.2012
R57 = R0402_4K7_1%_0.0625W_100PPM: Resistor - 1%; Part Description: General Purpose Thick Film Chip Resistor; Manufacturer: GENERIC; Manufacturer1 Part Number: 232270674702L; TC: ±100ppm/°C; PressFit: No; Part Number: R0402_4K7_1%_0.0625W_100PPM; Component Kind: Standard; Component Type: Standard; Pin Count: 2; Value: 4k7; Status: Not Recommended; Power: 0.0625W; Tolerance: ±1%; Manufacturer Part Number: R0402_4K7_1%_0.0625W_100PPM; Case: 0402; Mounted: Yes; Sense: No; Socket: No; SMD: Yes; Manufacturer1 Example: YAGEO PHYCOMP; Manufacturer1 ComponentHeight: 0.4mm; HelpURL: \\cern.ch\dfs\Applications\Altium\Datasheets\R0402_Phycomp_RC0402.pdf; Author: CERN DEM JLC; CreateDate: 03.12.2007; LatestRevisionDate: 17.10.2012
R62 R63 R66 R67 R69 R70 = R0402_10K_1%_0.0625W_100PPM: Resistor - 1%; Part Description: General Purpose Thick Film Chip Resistor; Manufacturer: GENERIC; Manufacturer1 Part Number: 232270671003L; TC: ±100ppm/°C; Table: Resistors SMD; Part Number: R0402_10K_1%_0.0625W_100PPM; Component Kind: Standard; Component Type: Standard; Pin Count: 2; Value: 10k; Status: Not recommended; Power: 0.0625W; Tolerance: ±1%; Manufacturer Part Number: R0402_10K_1%_0.0625W_100PPM; Case: 0402; Mounted: Yes; Socket: No; SMD: Yes; Manufacturer1 Example: YAGEO PHYCOMP; Manufacturer1 ComponentHeight: 0.4mm; HelpURL: \\cern.ch\dfs\Applications\Altium\Datasheets\R0402_Phycomp_RC0402.pdf; Author: CERN DEM JLC; CreateDate: 2007-12-03; LatestRevisionDate: 2012-10-17
R75 = R0402_22K_1%_0.0625W_100PPM: Resistor - 1%; Part Description: General Purpose Thick Film Chip Resistor; Manufacturer: GENERIC; Manufacturer1 Part Number: 232270672203L; TC: ±100ppm/°C; PressFit: No; Part Number: R0402_22K_1%_0.0625W_100PPM; Component Kind: Standard; Component Type: Standard; Pin Count: 2; Value: 22k; Status: Not Recommended; Power: 0.0625W; Tolerance: ±1%; Manufacturer Part Number: R0402_22K_1%_0.0625W_100PPM; Case: 0402; Mounted: Yes; Sense: No; Socket: No; SMD: Yes; Manufacturer1 Example: YAGEO PHYCOMP; Manufacturer1 ComponentHeight: 0.4mm; HelpURL: \\cern.ch\dfs\Applications\Altium\Datasheets\R0402_Phycomp_RC0402.pdf; Author: CERN DEM JLC; CreateDate: 03.12.2007; LatestRevisionDate: 17.10.2012
T24 = BSS138LT1G: N-CHANNEL MOSFET WITH DIODE; Part Description: 50V 200mA N-Channel Enhancement Mode Field-Effect Transistor; Manufacturer: ON SEMICONDUCTOR; PressFit: No; Bonding: No; Part Number: BSS138LT1G; Component Kind: Standard; Component Type: Standard; Device: BSS138LT1G; PackageDescription: SOT23 3-Leads, Pitch 0.95mm - Body 1.4x3mm, IPC Medium Density; Manufacturer Part Number: BSS138LT1G; Pin Count: 3; Case: SOT23-3; Mounted: Yes; Socket: No; SMD: Yes; Sense: No; ComponentHeight: 1.11mm; HelpURL: \\cern.ch\dfs\Applications\Altium\Datasheets\BSS138LT1G.pdf; Author: CERN DEM JLC; CreateDate: 23.03.2009; LatestRevisionDate: 23.03.2009

## Sheet W5500.SchDoc: Title
size 420 x 297 mm; Author: G.Kasprowicz; CompanyName: WUT ISE; DrawnBy: G.Kasprowicz; Organization: WUT ISE; Address1: PW ISE; Address2: Nowowiejska 15/19 00-665 Warsaw; Address3: gkasprow@gmail.com; Revision: 1.0; SheetNumber: -; SheetTotal: -; ModifiedBy: -; CheckedDate: -; Title2: Title2; DivGrp: WUT ISE; Designer: G.Kasprowicz; ModifiedDate: -; ProjectName: Sensor Box
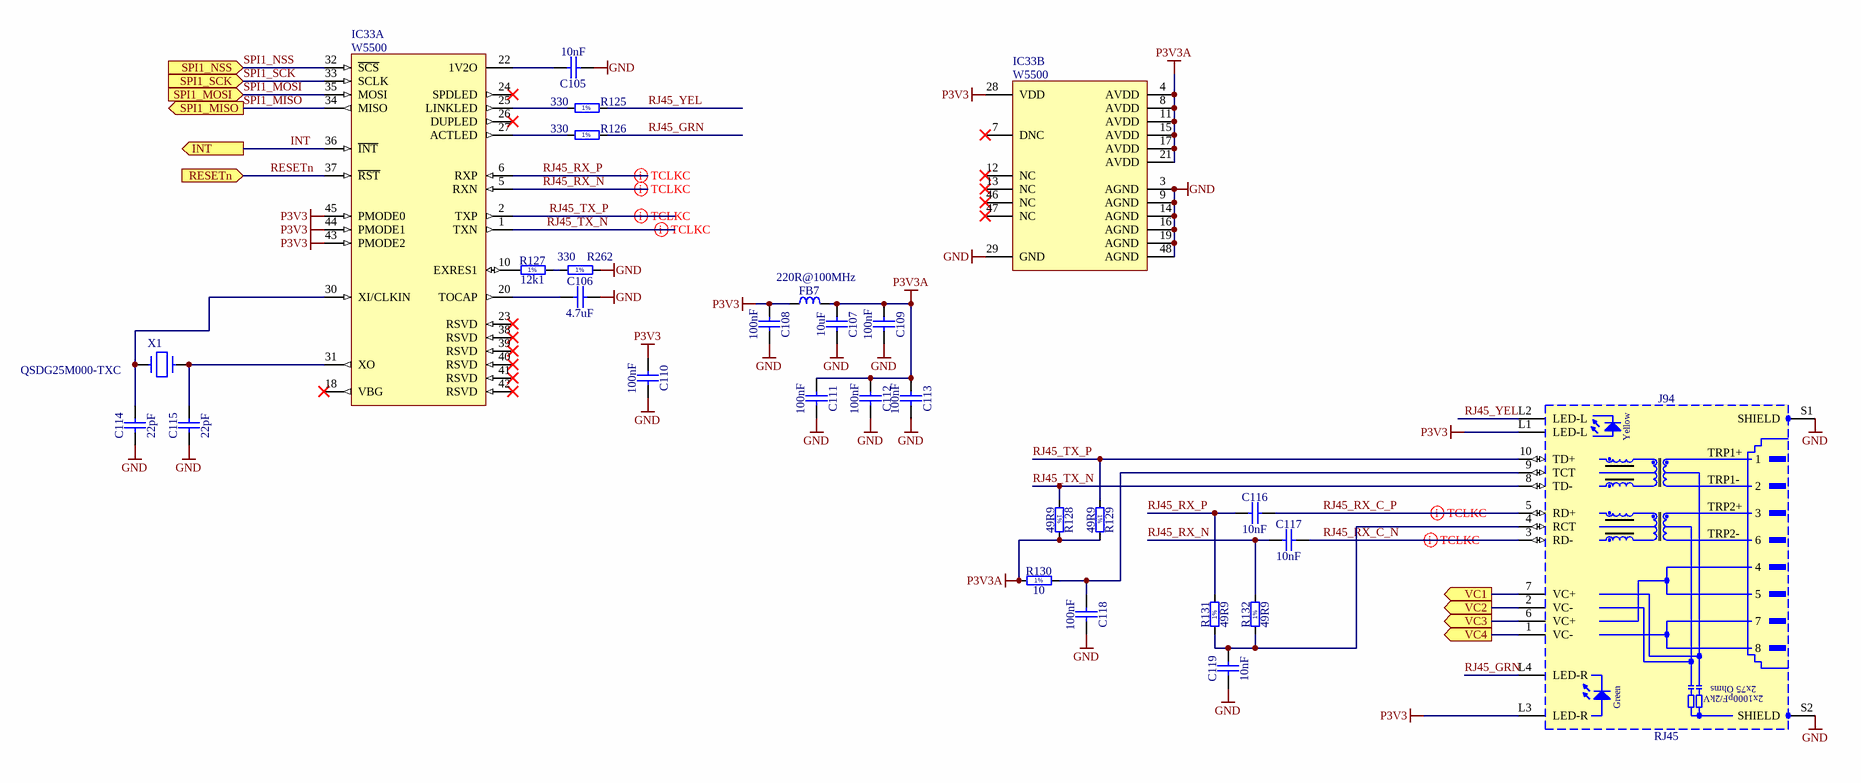
[diagram p6: W5500.SchDoc]

### Parts
C105  10nF  [CAPC1608X87N]
C106  4.7uF  [CAPC1608X90N]
C107  10uF  [CAPC2012X135N]
C108  100nF  [CAPC1005X55N]
C109  100nF  [CAPC1005X55N]
C110  100nF  [CAPC1005X55N]
C111  100nF  [CAPC1005X55N]
C112  100nF  [CAPC1005X55N]
C113  100nF  [CAPC1005X55N]
C114  22pF  [CAPC1005X55N]
C115  22pF  [CAPC1005X55N]
C116  10nF  [CAPC1608X87N]
C117  10nF  [CAPC1608X87N]
C118  100nF  [CAPC1005X55N]
C119  10nF  [CAPC1608X87N]
FB7  220R@100MHz  [INDC2012X105N]
IC33  W5500  [QFP50P900X900X160-48N]  (parts A,B of 2)
J94  RJ45  [ABRACON_ARJM11C7-114-BA-EW2]
R125  330  [RESC1005X40N]
R126  330  [RESC1005X40N]
R127  12k1  [RESC1005X40N]
R128  49R9  [RESC1005X40N]
R129  49R9  [RESC1005X40N]
R130  10  [RESC1005X40N]
R131  49R9  [RESC1005X40N]
R132  49R9  [RESC1005X40N]
R262  330  [RESC1005X40N]
X1  QSDG25M000-TXC  [XTAL_5.0*3.2]

### Ports
INT (out), RESETn (in), SPI1_MISO (out), SPI1_MOSI (in), SPI1_NSS (in), SPI1_SCK (in), VC1 (out), VC2 (out), VC3 (out), VC4 (out)

### Nets
GND: C105.1 C106.2 C107.2 C108.2 C109.2 C110.2 C111.2 C112.2 C113.2 C114.1 C115.1 C118.2 C119.1 IC33.3(AGND) IC33.9(AGND) IC33.14(AGND) IC33.16(AGND) IC33.19(AGND) IC33.29(GND) IC33.48(AGND) J94.S1(SHIELD) J94.S2(SHIELD) R262.2
P3V3: C108.1 C110.1 FB7.1 IC33.28(VDD) IC33.43(PMODE2) IC33.44(PMODE1) IC33.45(PMODE0) J94.L1(LED-L) J94.L3(LED-R)
P3V3A: C107.1 C109.1 C111.1 C112.1 C113.1 FB7.2 IC33.4(AVDD) IC33.8(AVDD) IC33.11(AVDD) IC33.15(AVDD) IC33.17(AVDD) IC33.21(AVDD) R128.2 R129.2 R130.1
INT: IC33.36(~{INT}) ; port INT
RESETn: IC33.37(~{RST}) ; port RESETn
RJ45_GRN: J94.L4(LED-R) R126.2
RJ45_RX_C_N: C117.2 J94.3(RD-)
RJ45_RX_C_P: C116.2 J94.5(RD+)
RJ45_RX_N: C117.1 IC33.5(RXN) R132.2
RJ45_RX_P: C116.1 IC33.6(RXP) R131.2
RJ45_TX_N: IC33.1(TXN) J94.8(TD-) R128.1
RJ45_TX_P: IC33.2(TXP) J94.10(TD+) R129.1
RJ45_YEL: J94.L2(LED-L) R125.2
SPI1_MISO: IC33.34(MISO) ; port SPI1_MISO
SPI1_MOSI: IC33.35(MOSI) ; port SPI1_MOSI
SPI1_NSS: IC33.32(~{SCS}) ; port SPI1_NSS
SPI1_SCK: IC33.33(SCLK) ; port SPI1_SCK
NetC105_2: C105.2 IC33.22(1V2O)
NetC106_1: C106.1 IC33.20(TOCAP)
NetC114_2: C114.2 IC33.30(XI/CLKIN) X1.1
NetC115_2: C115.2 IC33.31(XO) X1.2
NetC118_1: C118.1 J94.9(TCT) R130.2
NetC119_2: C119.2 J94.4(RCT) R131.1 R132.1
NetIC33_10: IC33.10(EXRES1) R127.1
NetIC33_25: IC33.25(LINKLED) R125.1
NetIC33_27: IC33.27(ACTLED) R126.1
NetJ94_1: J94.1(VC-) ; port VC4
NetJ94_2: J94.2(VC-) ; port VC2
NetJ94_6: J94.6(VC+) ; port VC3
NetJ94_7: J94.7(VC+) ; port VC1
NetR127_2: R127.2 R262.1

Not connected (* = marked no-connect by the designer): IC33 7(DNC)* 12(NC)* 13(NC)* 18(VBG)* 23(RSVD)* 24(SPDLED)* 26(DUPLED)* 38(RSVD)* 39(RSVD)* 40(RSVD)* 41(RSVD)* 42(RSVD)* 46(NC)* 47(NC)*

### Layout directives
differential pair: RJ45_RX_C_N, RJ45_RX_C_P, RJ45_RX_N, RJ45_RX_P, RJ45_TX_N, RJ45_TX_P

### Notes on the sheet
- Project/Equipment
- Document
- Designer
- Drawn by
- Check.by
- Copyright WUT ISE 2018.
  This documentation describes Open Hardware and is licensed under the CERN OHL v.1.1. You may redistribute and modify this documentation under the terms of the CERN OHL v.1.1. (http://ohwr.org/CERNOHL). This documentation is distributed WITHOUT ANY EXPRESS OR IMPLIED WARRANTY, INCLUDING OF MERCHANTABILITY, SATISFACTORY QUALITY AND FITNESS FOR A PARTICULAR PURPOSE. Please see the CERN OHL v.1.1 for applicable conditions.
- Contact
- File
- Last Mod.
- Print Date
- Sheet
- Size
- A3
- of
- Rev
- (in symbol CON_ETH_POE_ARJM11C7) Yellow; TRP1+; TRP1-; TRP2+; TRP2-; 2x75 Ohms; Green; 2x1000pF/2kV
- (in symbol R0402_10R_1%_0.0625W_200PPM) 1%
- (in symbol R0402_12K1_1%_0.0625W_100PPM) 1%
- (in symbol R0402_49R9_1%_0.0625W_100PPM) 1%
- (in symbol R0402_330R_1%_0.0625W_100PPM) 1%

### Library data of the parts
C105 C116 C117 C119 = CC0603_10NF_50V_5%_C0G: Non-polarised capacitor; Part Description: SMD Multilayer Chip Ceramic Capacitor; Manufacturer: GENERIC; Manufacturer1 Part Number: C1608C0G1H103J080AA; Voltage: 50V; TC: C0G/NP0; Tolerance: ±5%; Part Number: CC0603_10NF_50V_5%_C0G; Component Kind: Standard; Component Type: Standard; Pin Count: 2; Value: 10nF; Status: Preferred; Manufacturer Part Number: CC0603_10NF_50V_5%_C0G; Case: 0603; Mounted: Yes; Socket: No; SMD: Yes; Sense: No; Manufacturer1 Example: TDK; Manufacturer1 ComponentHeight: 0.9mm; HelpURL: \\cern.ch\dfs\Applications\Altium\Datasheets\CC0603_C0G_TDK_C.pdf; Author: CERN DEM JLC; CreateDate: 10.12.2014; LatestRevisionDate: 10.12.2014
C106 = CC0603_4.7UF_25V_10%_X5R: Non-polarised capacitor; Part Description: SMD Multilayer Chip Ceramic Capacitor; Manufacturer: GENERIC; Manufacturer1 Part Number: GRM188R61E475KE11D; Voltage: 25V; TC: X5R; Tolerance: ±10%; Part Number: CC0603_4.7UF_25V_10%_X5R; Component Kind: Standard; Component Type: Standard; Pin Count: 2; Value: 4.7uF; Status: None; Manufacturer Part Number: CC0603_4.7UF_25V_10%_X5R; Case: 0603; Mounted: Yes; Socket: No; SMD: Yes; Sense: No; Manufacturer1 Example: MURATA; Manufacturer1 ComponentHeight: 0.95mm; HelpURL: \\cern.ch\dfs\Applications\Altium\Datasheets\CC0603_MURATA_GRM188R61E475KE11D.pdf; Author: CERN DEM JLC; CreateDate: 10.11.2014; LatestRevisionDate: 10.11.2014
C107 = CC0805_10UF_16V_10%_X5R: as C56 on sheet Sensor_Box_Hub_SAMD21; Part Number: CC0805_10UF_16V_10%_X5R; Component Kind: Standard; Component Type: Standard; Pin Count: 2; Value: 10uF; Status: Preferred; Manufacturer Part Number: CC0805_10UF_16V_10%_X5R; Case: 0805; Mounted: Yes; Socket: No; SMD: Yes; Manufacturer1 Example: KEMET; Manufacturer1 ComponentHeight: 1.4mm; HelpURL: \\cern.ch\dfs\Applications\Altium\Datasheets\CC1206_X5R_KEMET.pdf; Author: CERN DEM JLC; CreateDate: 03.12.2007; LatestRevisionDate: 03.12.2007; Sense: No
C108-C113 C118 = CC0402_100NF_16V_10%_X7R: as C4 on sheet Sensor_Box_Hub_SAMD21; Part Number: CC0402_100NF_16V_10%_X7R; Component Kind: Standard; Component Type: Standard; Pin Count: 2; Value: 100nF; Status: Not Recommended; Manufacturer Part Number: CC0402_100NF_16V_10%_X7R; Case: 0402; Mounted: Yes; Socket: No; SMD: Yes; Manufacturer1 Example: MURATA; Manufacturer1 ComponentHeight: 0.55mm; HelpURL: \\cern.ch\dfs\Applications\Altium\Datasheets\CC0402_X7R_MURATA_GRM.pdf; Author: CERN DEM JLC; CreateDate: 05.12.2013; LatestRevisionDate: 03.12.2007; Sense: No
C114 C115 = CC0402_22PF_50V_5%_NP0: Non-polarised capacitor; Part Description: SMD Multilayer Chip Ceramic Capacitor; Manufacturer: GENERIC; Manufacturer1 Part Number: 223886915229; Voltage: 50V; TC: NP0; Tolerance: ±5%; Table: Capacitors SMD; Part Number: CC0402_22PF_50V_5%_NP0; Component Kind: Standard; Component Type: Standard; Pin Count: 2; Value: 22pF; Status: Not Recommended; Manufacturer Part Number: CC0402_22PF_50V_5%_NP0; Case: 0402; Mounted: Yes; Socket: No; SMD: Yes; Manufacturer1 Example: PHYCOMP; Manufacturer1 ComponentHeight: 0.55mm; HelpURL: \\cern.ch\dfs\Applications\Altium\Datasheets\CC0402_NP0_PHYCOMP.pdf; Author: CERN DEM JLC; CreateDate: 2007-12-03; LatestRevisionDate: 2007-12-03
FB7 = IND0805_MURATA_BLM21PG221SN1D: as FB2 on sheet Sensor_Box_Hub_SAMD21; Part Number: IND0805_MURATA_BLM21PG221SN1D; Component Kind: Standard; Component Type: Standard; Pin Count: 2; Value: 220R@100MHz; Status: None; Manufacturer Part Number: BLM21PG221SN1D; Case: 0805; Mounted: Yes; Socket: No; SMD: Yes; ComponentHeight: 1.05mm; HelpURL: \\cern.ch\dfs\Applications\Altium\Datasheets\IND0402_MURATA_BLM21P.pdf; Author: CERN DEM JLC; CreateDate: 2010-01-25; LatestRevisionDate: 2010-01-25
IC33 = W5500: iEthernet W5500 TCP/IP Performance and High Speed SPI Ethernet Controller; Manufacturer: WIZNET; PressFit: No; Bonding: No; Part Number: W5500; Component Kind: Standard; Component Type: Standard; Device: W5500; PackageDescription: QFP, 0.50mm Pitch, Square, 48 Pin, 7.00mm L X 7.00mm W X 1.60mm H Body, IPC Medium Density; Part Description: iEthernet W5500 TCP/IP Performance and High Speed SPI Ethernet Controller; Manufacturer Part Number: W5500; Pin Count: 48; Case: QFP48; Mounted: Yes; Socket: No; SMD: Yes; Sense: No; ComponentHeight: 1.6mm; Author: CERN DEM MR; HelpURL: \\cern.ch\dfs\Applications\Altium\Datasheets\W5500.pdf; CreateDate: 15.02.2018; LatestRevisionDate: 15.02.2018
J94 = CON_ETH_POE_ARJM11C7: MagJack 10/100BaseT, PoE+, 1X1, OG/Y, -40 to 85*C, Tab Up, RoHS; Part Number: ARJM11C7-114-BA-EW2; Part Description: 1 Port, Orange Green/Yellow LEDs, RJ45 10/100BaseT, PoE, Ethernet MagJack® Connector Module; Manufacturer: Abracon; PressFit: No; Component Kind: Standard; Component Type: Standard; Pin Count: 18; Family: RJ45; Mounted: Yes; Socket: No; SMD: No; Sense: No; Status: None; Manufacturer Part Number: ARJM11C7-114-BA-EW2; ComponentHeight: 13.61mm; HelpURL: \\cern.ch\dfs\Applications\Altium\Datasheets\BELFUSE_0826-1X1T-GJ-F.pdf; Author: GK; CreateDate: 05.11.2012; LatestRevisionDate: 05.11.2012
R125 R126 R262 = R0402_330R_1%_0.0625W_100PPM: Resistor - 1%; Part Description: General Purpose Thick Film Chip Resistor; Manufacturer: GENERIC; Manufacturer1 Part Number: 232270673301L; TC: ±100ppm/°C; PressFit: No; Part Number: R0402_330R_1%_0.0625W_100PPM; Component Kind: Standard; Component Type: Standard; Pin Count: 2; Value: 330; Status: Not Recommended; Power: 0.0625W; Tolerance: ±1%; Manufacturer Part Number: R0402_330R_1%_0.0625W_100PPM; Case: 0402; Mounted: Yes; Sense: No; Socket: No; SMD: Yes; Manufacturer1 Example: YAGEO PHYCOMP; Manufacturer1 ComponentHeight: 0.4mm; HelpURL: \\cern.ch\dfs\Applications\Altium\Datasheets\R0402_Phycomp_RC0402.pdf; Author: CERN DEM JLC; CreateDate: 03.12.2007; LatestRevisionDate: 17.10.2012
R127 = R0402_12K1_1%_0.0625W_100PPM: Resistor - 1%; Part Description: General Purpose Thick Film Chip Resistor; Manufacturer: GENERIC; Manufacturer1 Part Number: 232270671213L or RC0402FR-0712K1L; TC: ±100ppm/°C; PressFit: No; Part Number: R0402_12K1_1%_0.0625W_100PPM; Component Kind: Standard; Component Type: Standard; Pin Count: 2; Value: 12k1; Status: Not Recommended; Power: 0.0625W; Tolerance: ±1%; Manufacturer Part Number: R0402_12K1_1%_0.0625W_100PPM; Case: 0402; Mounted: Yes; Sense: No; Socket: No; SMD: Yes; Manufacturer1 Example: YAGEO PHYCOMP; Manufacturer1 ComponentHeight: 0.4mm; HelpURL: \\cern.ch\dfs\Applications\Altium\Datasheets\R0402_Phycomp_RC0402.pdf; Author: CERN DEM JLC; CreateDate: 24.10.2012; LatestRevisionDate: 24.10.2012
R128 R129 R131 R132 = R0402_49R9_1%_0.0625W_100PPM: as R19 on sheet Sensor_Box_Hub_SAMD21; Part Number: R0402_49R9_1%_0.0625W_100PPM; Component Kind: Standard; Component Type: Standard; Pin Count: 2; Value: 49R9; Status: Not recommended; Power: 0.0625W; Tolerance: ±1%; Manufacturer Part Number: R0402_49R9_1%_0.0625W_100PPM; Case: 0402; Mounted: Yes; Socket: No; SMD: Yes; Manufacturer1 Example: YAGEO PHYCOMP; Manufacturer1 ComponentHeight: 0.4mm; HelpURL: \\cern.ch\dfs\Applications\Altium\Datasheets\R0402_Phycomp_RC0402.pdf; Author: CERN DEM JLC; CreateDate: 2012-10-24; LatestRevisionDate: 2012-10-24
R130 = R0402_10R_1%_0.0625W_200PPM: Resistor - 1%; Part Description: General Purpose Thick Film Chip Resistor; Manufacturer: GENERIC; Manufacturer1 Part Number: 232270671009L; TC: ±200ppm/°C; Part Number: R0402_10R_1%_0.0625W_200PPM; Component Kind: Standard; Component Type: Standard; Pin Count: 2; Value: 10; Status: Not recommended; Power: 0.0625W; Tolerance: ±1%; Manufacturer Part Number: R0402_10R_1%_0.0625W_200PPM; Case: 0402; Mounted: Yes; Sense: No; Socket: No; SMD: Yes; Manufacturer1 Example: YAGEO PHYCOMP; Manufacturer1 ComponentHeight: 0.4mm; HelpURL: \\cern.ch\dfs\Applications\Altium\Datasheets\R0402_Phycomp_RC0402.pdf; Author: CERN DEM JLC; CreateDate: 24.06.2009; LatestRevisionDate: 17.10.2012
X1 = X_CRYSTAL_SMD_5.0*3.2: miniature crystal oscillator (Maritex)